# EAGLE design Hall Switch (EAGLE 7.7.0)
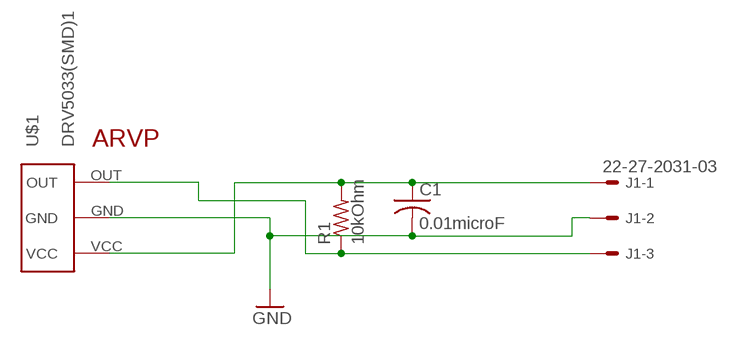
[diagram p0: schematic, sheet 1]

## Parts
C1  0.01microF  C-USC2012  [C2012]
J1  22-27-2031-03  [6410-03]
R1  10kOhm  R-US_M2012  [M2012]
U$1  DRV5033(SMD)1  [SOT-23]
U$2  ARVP_LOGO  [ARVP]

## Nets
3.3V: C1.1 J1.1 R1.2 U$1.VCC
GND: C1.2 J1.2 U$1.GND
HALL: J1.3 R1.1 U$1.OUT

## Library data of the parts
C1 = rcl:C-US: CAPACITOR, American symbol
J1 = con-molex:22-?-03: CONNECTOR wire to board 2.54 mm (.1 inch) pitch header; OC_FARNELL: unknown; OC_NEWARK: unknown
R1 = resistor:R-US_: RESISTOR, American symbol
U$1 = Moira:DRV5033(SMD)
U$2 = ARVP:ARVP_LOGO

## Board
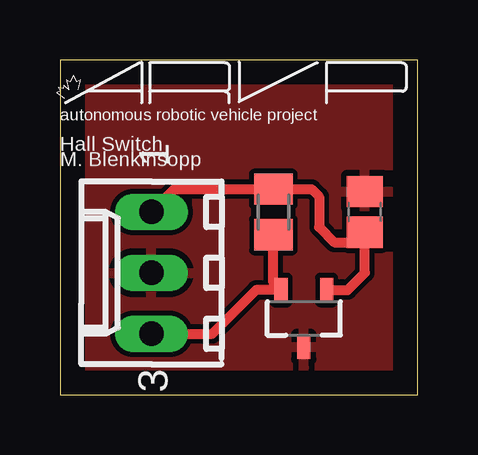
[diagram p1: board, top side]
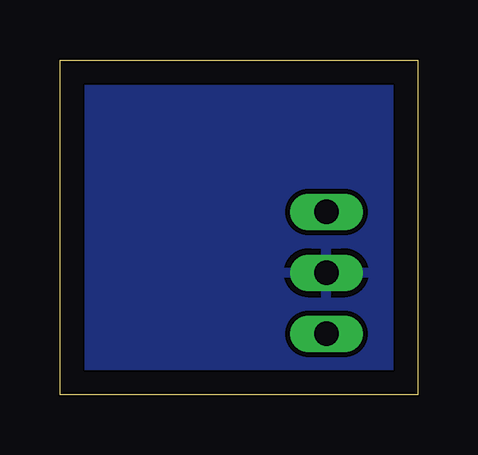
[diagram p2: board, bottom side, seen from below]

Size 14.91 x 13.96 mm. Coordinates in mm from the lower left corner, seen from the top.
Outline: 0,0 14.91,0 14.91,13.96 0,13.96 0,0
Copper layers (1*16): Top 0.035mm / dielectric 1.5mm / Bottom 0.035mm
Design rules "default": minimum track width 10mil, minimum drill 24mil, track to track 8mil, track to pad 8mil, pad to pad 8mil, via to via 8mil, smd to smd 8mil, copper to edge 40mil, drill to drill 8mil, minimum pad ring 10mil, minimum via ring 8mil, stop-mask expansion 4mil, vias tented up to drill 0mil, thermal gap 10mil

### Footprints (pad centres in the part's own frame; a part is rotated, then mirrored left to right if it is on the bottom)
C2012 = smd 1.3 x 1.5: 1 -0.85,0; 2 0.85,0
6410-03 = drill 1.016 long: 1 2.54,0; 2 0,0; 3 -2.54,0
M2012 = smd 1.3 x 1.6: 1 -0.95,0; 2 0.95,0
SOT-23 = smd 0.55 x 1.016: GND 0,1.185; OUT 0.95,-1.185; VCC -0.95,-1.185

### Placement (x,y rotation side)
C1  12.7,7.62 90 top
J1  3.81,5.08 90 top
R1  8.89,7.62 90 top
U$1  10.16,3.18 180 top
U$2  0,11.43 0 top

### Tracks (layer width: path | path; a pad name or v marks a point on that pad's centre or on a via)
3.3V
  Top 0.406: J1.1 4.76,8.57 R1.2 10.48,8.57 10.79,8.26 10.79,6.99 11.43,6.35 12.28,6.35 C1.1 12.7,5.08 11.98,4.36 U$1.VCC
GND
  pour Top: 0,13.97 0,0 15.24,0 15.24,13.97
  pour Bottom: 0,13.97 0,0 15.24,0 15.24,13.97
HALL
  Top 0.406: J1.3 6.35,2.54 8.17,4.36 U$1.OUT 8.89,4.68 R1.1

### Text on the board
tPlace: Hall Switch | M. Blenkinsopp